# EasyEDA schematic dazzler-schematic.json

## Sheets
1 Audio
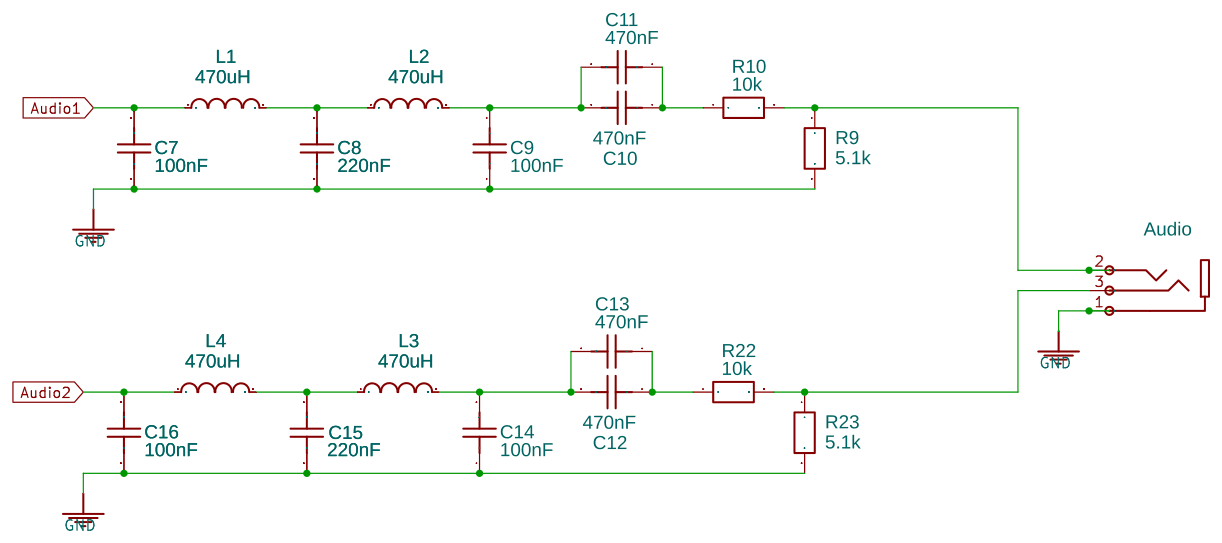
[diagram p0: Audio]
2 MCU
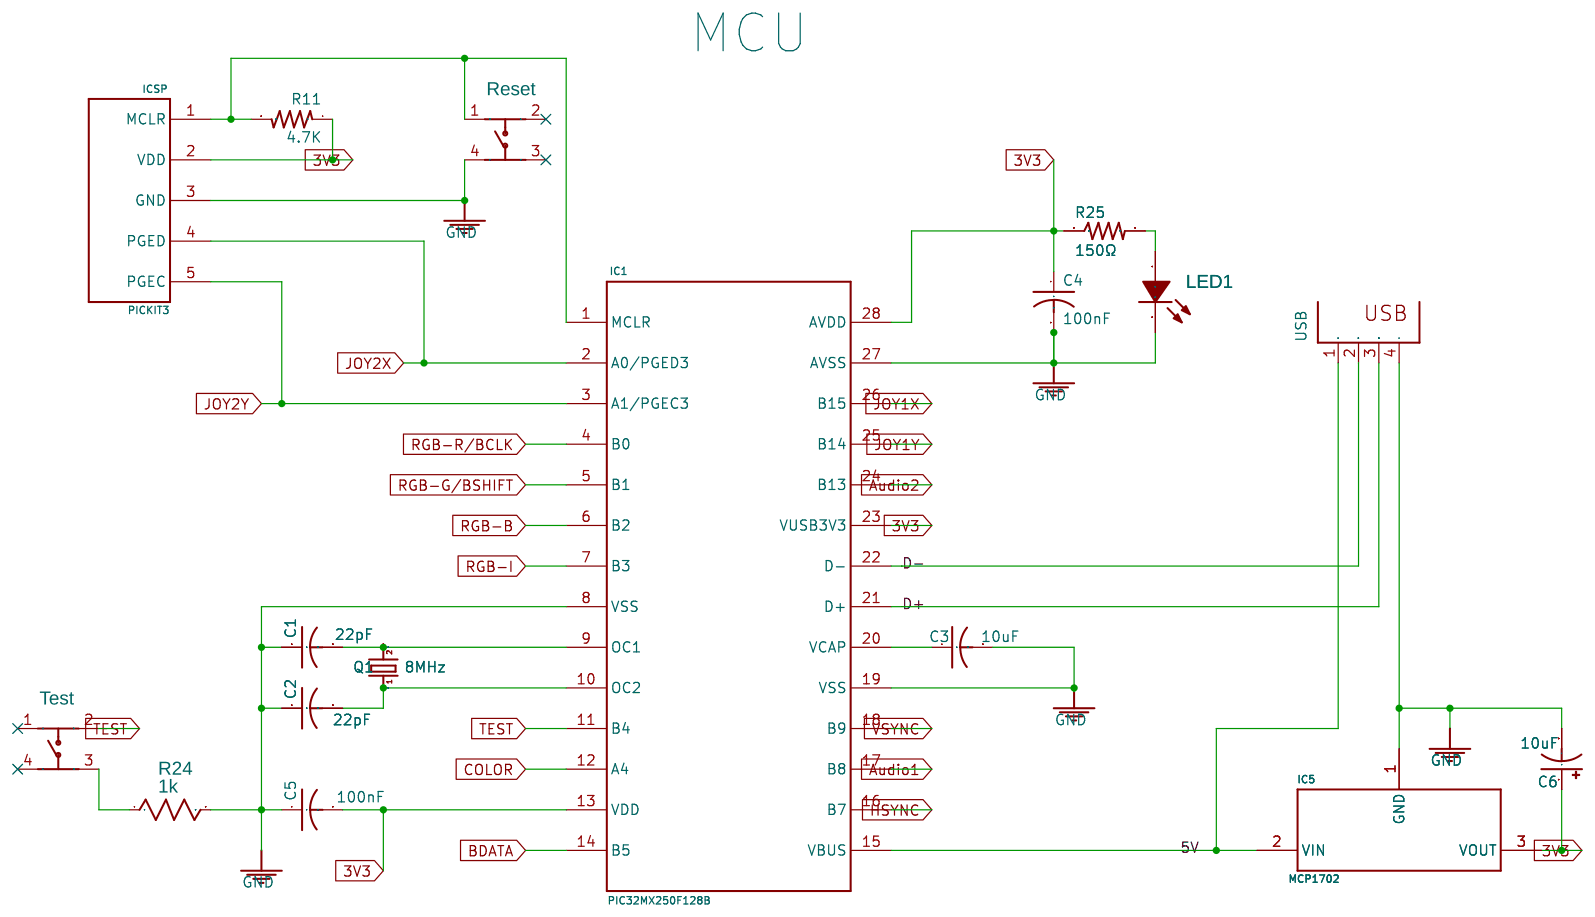
[diagram p1: MCU]
3 Video
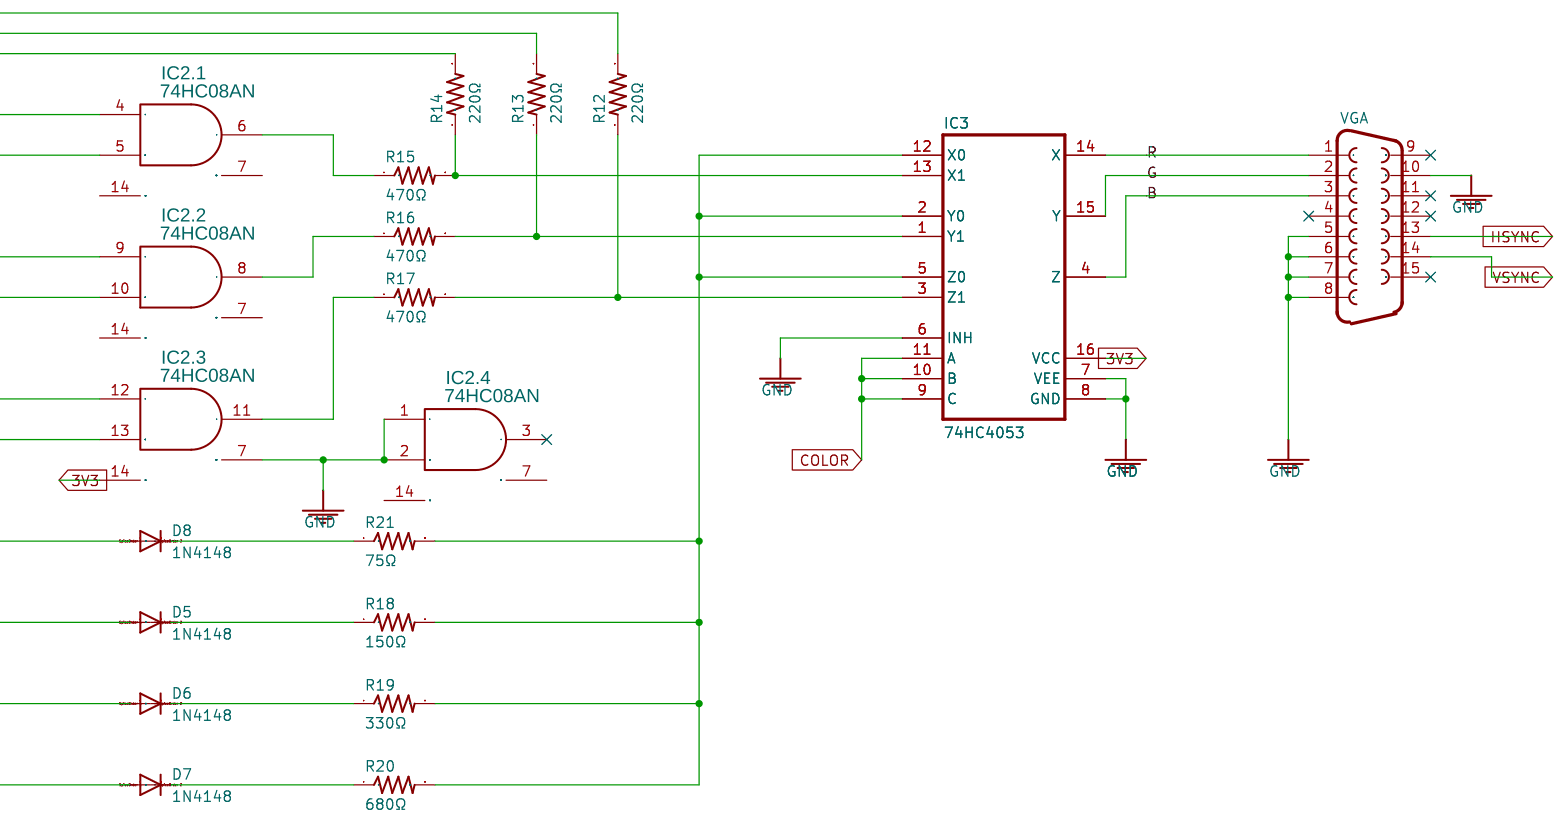
[diagram p2: Video]
4 Joystick Connection
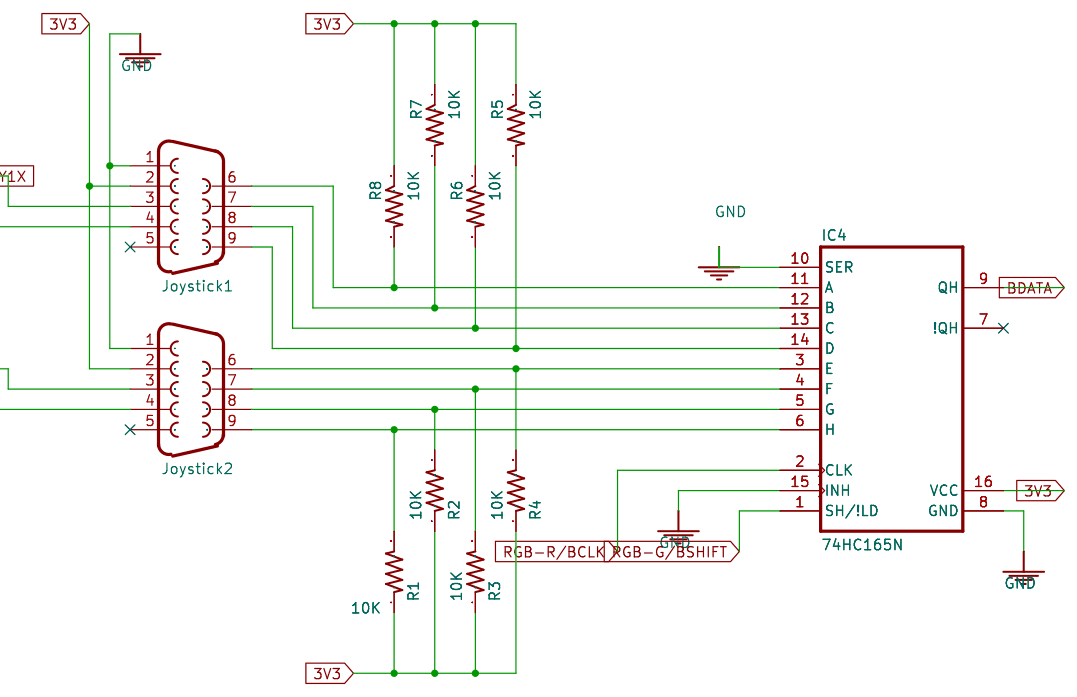
[diagram p3: Joystick Connection]

## Parts
sheet Audio
C7  100nF  [RAD-0.1]
C8  220nF  [RAD-0.2]
C9  100nF  [RAD-0.1]
C10  470nF  [RAD-0.2]
C11  470nF  [RAD-0.2]
C12  470nF  [RAD-0.2]
C13  470nF  [RAD-0.2]
C14  100nF  [RAD-0.1]
C15  220nF  [RAD-0.2]
C16  100nF  [RAD-0.1]
J1  Audio  [AUDIO_TH_PJ-3210-4A]
L1  470uH  [AXIAL-0.4]
L2  470uH  [AXIAL-0.4]
L3  470uH  [AXIAL-0.4]
L4  470uH  [AXIAL-0.4]
R9  5.1k  [AXIAL-0.4]
R10  10k  [AXIAL-0.4]
R22  10k  [AXIAL-0.4]
R23  5.1k  [AXIAL-0.4]
sheet Joystick Connection
IC4  74HC165N  [DIL16]
JS1  Joystick1  [DSUB-TH_DMR-9S]
JS2  Joystick2  [DSUB-TH_DMR-9S]
R1  10K  [AXIAL-0.4]
R2  10K  [AXIAL-0.4]
R3  10K  [AXIAL-0.4]
R4  10K  [AXIAL-0.4]
R5  10K  [AXIAL-0.4]
R6  10K  [AXIAL-0.4]
R7  10K  [AXIAL-0.4]
R8  10K  [AXIAL-0.4]
sheet MCU
C1  22pF  [RAD-0.2]
C2  22pF  [RAD-0.2]
C3  10uF  [TANTALUM]
C4  100nF  [RAD-0.1]
C5  100nF  [RAD-0.1]
C6  10uF  [CAP-6.3*12]
IC1  PIC32MX250F128B  [DIL28-3]
IC5  MCP1702  [TO-92-3_L6.1-W5.0-P1.50-L]
ICSP  PICKIT3  [PICKIT]
KEY1  Test  [KEY-TH_4P-L6.0-W6.0-P4.50-LS7.5]
KEY2  Reset  [KEY-TH_4P-L6.0-W6.0-P4.50-LS7.5]
LED1  Power  [LED-3MM/2.54]
Q1  8MHz  [49S-CRYSTAL]
R11  4.7K  [AXIAL-0.4]
R24  1k  [AXIAL-0.4]
R25  150Ω  [AXIAL-0.4]
USB  PN61729  [USB-A-TH_USB-A-F-90]
sheet Video
D5  1N4148  [DO35-7]
D6  1N4148  [DO35-7]
D7  1N4148  [DO35-7]
D8  1N4148  [DO35-7]
IC2  74HC08AN  [DIP14]  (sections 1,2,3,4)
IC3  74HC4053  [DIL16]
R12  220Ω  [AXIAL-0.4]
R13  220Ω  [AXIAL-0.4]
R14  220Ω  [AXIAL-0.4]
R15  470Ω  [AXIAL-0.4]
R16  470Ω  [AXIAL-0.4]
R17  470Ω  [AXIAL-0.4]
R18  150Ω  [AXIAL-0.4]
R19  330Ω  [AXIAL-0.4]
R20  680Ω  [AXIAL-0.4]
R21  75Ω  [AXIAL-0.4]
VGA  F15HDV  [DSUB-TH_15P-P2.29-H-F_DDMRH15PFE006]

## Library data of the parts
C7 C14 C16 = Cap_RAD-0.1_US: Supplier Part: C154503; Supplier: LCSC
C8 C15 = Cap_RAD-0.1_US: Supplier: LCSC; Supplier Part: C94714
C9 = Cap_RAD-0.1_US: Supplier: LCSC; Supplier Part: C154503
C10-C13 = Cap_RAD-0.1_US: Supplier Part: C341275; Supplier: LCSC
J1 = -: Supplier Part: C136686; Supplier: LCSC; Manufacturer: ReliaPro; Manufacturer Part: 320B/PJ-001 3.5Jacks; image: http://image.lceda.cn/szlcsc/C3792.jpg
L1 = Inductor_AXIAL-0.4_US: Supplier Part: M10142-ND; Supplier: Digi-Key; Package Display: No
L2-L4 = Inductor_AXIAL-0.4_US: Supplier Part: M10142-ND; Supplier: Digi-Key
R9 R23 = Res_AXIAL-0.3(1/8W)_EU: Supplier: LCSC; Supplier Part: C120072
R10 = Res_AXIAL-0.3(1/8W)_EU: Supplier: LCSC; Supplier Part: C61299
R22 = Res_AXIAL-0.3(1/8W)_EU: Supplier Part: C61299; Supplier: LCSC
IC4 = -: Supplier: LCSC; Manufacturer: TI; Manufacturer Part: SN74HC165N; Supplier Part: C2909
JS1 = -: Package Display: No; Supplier: LCSC; Supplier Part: C141882; Manufacturer: Ckmtw
JS2 = -: Supplier Part: C141882; Supplier: LCSC
R1-R8 = -: Supplier: LCSC; Supplier Part: C61299
C1 C2 = -: Supplier: LCSC; Supplier Part: C260725
C3 = -: Supplier: LCSC; Supplier Part: C28244
C4 = -: Supplier: LCSC; Supplier Part: C154503
C5 = -: Supplier Part: C154503; Supplier: LCSC
C6 = -: Supplier Part: C235682; Supplier: LCSC
IC1 = -: Manufacturer: Microchip; Supplier: Digi-Key; Supplier Part: PIC32MX250F128B-I/SP-ND
IC5 = -: Supplier Part: MCP1700-3302E/TO; Supplier: Digi-Key; Manufacturer: Microchip
ICSP = -: Supplier Part: C225492; Supplier: LCSC
KEY1 KEY2 = -: Supplier Part: C110153; Supplier: LCSC; image: http://image.lceda.cn/szlcsc/C59982.jpg
LED1 = -: Supplier: LCSC; Manufacturer: EVERLIGHT; Manufacturer Part: 204-10SURD/S530-A3; Supplier Part: C99772
Q1 = -: Package Display: No; Supplier: LCSC; Supplier Part: C188205
R11 = -: Supplier: LCSC; Supplier Part: C120071
R24 = Res_1206(1/4W)_US: Supplier: LCSC; Supplier Part: C120055
R18 R25 = -: Supplier: LCSC; Supplier Part: C70814
USB = -: Supplier: LCSC; Supplier Part: C2344
D5-D8 = -: Supplier: LCSC; Supplier Part: C14516
IC2 = -: Quad 2-Input AND Gate; subpart_no: 4; Supplier Part: C2887; Supplier: LCSC
IC3 = -: Supplier Part: CD74HC4053EG4-ND; Supplier: Digi-Key
R12-R14 = -: Supplier: LCSC; Supplier Part: C61289
R15-R17 = -: Supplier: LCSC; Supplier Part: C120047
R19 = -: Supplier: LCSC; Supplier Part: C120043
R20 = -: Supplier Part: C70784; Supplier: LCSC
R21 = -: Supplier: LCSC; Supplier Part: C70779
VGA = -: Supplier: LCSC; Supplier Part: C379814

## Nets
3V3: C4.1 C5.2 C6.1(+) IC1.13(VDD) IC1.23(VUSB3V3) IC1.28(AVDD) IC2.14(VCC) IC3.16(VCC) IC4.16(VCC) IC5.3(VOUT) ICSP.2(VDD) JS1.2 JS2.2 R1.1 R2.1 R3.1 R4.1 R5.1 R6.1 R7.1 R8.1 R11.1 R25.1
5V: IC1.15(VBUS) IC5.2(VIN) USB.1
GND: C1.1 C2.1 C3.2 C4.2 C5.1 C6.2(-) C7.1 C8.1 C9.1 C14.1 C15.1 C16.1 IC1.8(VSS) IC1.19(VSS) IC1.27(AVSS) IC2.1(A) IC2.2(B) IC2.7(GND) IC3.6(INH) IC3.7(VEE) IC3.8(GND) IC4.8(GND) IC4.10(SER) IC4.15(INH) IC5.1(GND) ICSP.3(GND) J1.1 JS1.1 JS2.1 KEY2.4 LED1.2(K) R9.2 R23.2 R24.2 USB.4 VGA.5 VGA.6 VGA.7 VGA.8 VGA.10
Audio1: C7.2 IC1.17(B8) L1.1
Audio2: C16.2 IC1.24(B13) L4.1
B: IC3.4(Z) VGA.3
BDATA: IC1.14(B5) IC4.9(QH)
COLOR: IC1.12(A4) IC3.9(C) IC3.10(B) IC3.11(A)
D+: IC1.21(D+) USB.3
D-: IC1.22(D-) USB.2
G: IC3.15(Y) VGA.2
HSYNC: IC1.16(B7) VGA.13
JOY1X: IC1.26(B15) JS1.3
JOY1Y: IC1.25(B14) JS1.4
JOY2X: IC1.2(A0/PGED3) ICSP.4(PGED) JS2.3
JOY2Y: IC1.3(A1/PGEC3) ICSP.5(PGEC) JS2.4
R: IC3.14(X) VGA.1
RGB-B: D5.A IC1.6(B2) IC2.12(A) R12.2
RGB-G/BSHIFT: D6.A IC1.5(B1) IC2.9(A) IC4.1(SH/!LD) R13.2
RGB-I: D8.A IC1.7(B3) IC2.5(B) IC2.10(B) IC2.13(B)
RGB-R/BCLK: D7.A IC1.4(B0) IC2.4(A) IC4.2(CLK) R14.2
TEST: IC1.11(B4) KEY1.2
VSYNC: IC1.18(B9) VGA.14
C3_1: C3.1 IC1.20(VCAP)
C12_1: C12.1 C13.1 R22.1
C12_2: C12.2 C13.2 C14.2 L3.2
C15_2: C15.2 L3.1 L4.2
J1_2: J1.2 R9.1 R10.2
J1_3: J1.3 R22.2 R23.1
KEY1_3: KEY1.3 R24.1
L1_2: C8.2 L1.2 L2.1
L2_2: C9.2 C10.2 C11.2 L2.2
Q1_1: C2.2 IC1.10(OC2) Q1.1
Q1_2: C1.2 IC1.9(OC1) Q1.2
R1_2: IC4.6(H) JS2.9 R1.2
R2_2: IC4.5(G) JS2.8 R2.2
R3_2: IC4.4(F) JS2.7 R3.2
R4_2: IC4.3(E) JS2.6 R4.2
R5_2: IC4.14(D) JS1.9 R5.2
R6_2: IC4.13(C) JS1.8 R6.2
R7_2: IC4.12(B) JS1.7 R7.2
R8_2: IC4.11(A) JS1.6 R8.2
R10_1: C10.1 C11.1 R10.1
R11_2: IC1.1(MCLR) ICSP.1(MCLR) KEY2.1 R11.2
R12_1: IC3.3(Z1) R12.1 R17.2
R13_1: IC3.1(Y1) R13.1 R16.2
R14_1: IC3.13(X1) R14.1 R15.2
R15_1: IC2.6(Y) R15.1
R16_1: IC2.8(Y) R16.1
R17_1: IC2.11(Y) R17.1
R18_1: D5.C R18.1
R18_2: IC3.2(Y0) IC3.5(Z0) IC3.12(X0) R18.2 R19.2 R20.2 R21.2
R19_1: D6.C R19.1
R20_1: D7.C R20.1
R21_1: D8.C R21.1
R25_2: LED1.1(A) R25.2

Not connected (* = marked no-connect by the designer): IC2 3(Y)*; IC4 7(!QH)*; JS1 5*; JS2 5*; KEY1 1* 4*; KEY2 2* 3*; VGA 4* 9* 11* 12* 15*

## Notes on the sheets
sheet 1
- Audio filter
sheet 2
- MCU
sheet 3
- Video Signal Generator
sheet 4
- Joystick Connection
